# EAGLE design Grove-Base-for-RasPi (EAGLE 7.6.0)
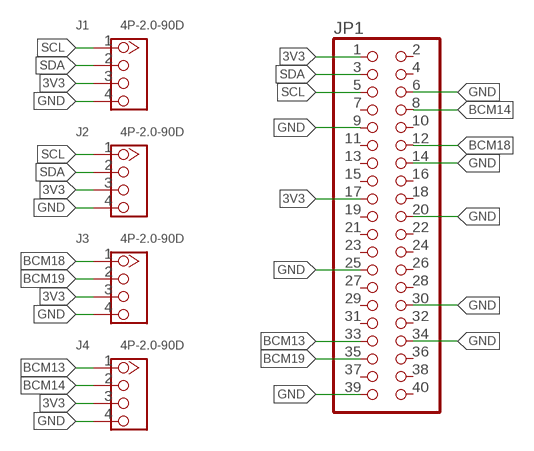
[diagram p0: schematic, sheet 1]

## Parts
J1  4P-2.0-90D  GROVE-CONNECTOR-DIP-90D(4P-2.0)  [HW4-2.0-90D]
J2  4P-2.0-90D  GROVE-CONNECTOR-DIP-90D(4P-2.0)  [HW4-2.0-90D]
J3  4P-2.0-90D  GROVE-CONNECTOR-DIP-90D(4P-2.0)  [HW4-2.0-90D]
J4  4P-2.0-90D  GROVE-CONNECTOR-DIP-90D(4P-2.0)  [HW4-2.0-90D]
JP1  PINHD-2X20  [2X20]

## Nets
3V3: J1.3 J2.3 J3.3 J4.3 JP1.1 JP1.17
BCM13: J4.1 JP1.33
BCM14: J4.2 JP1.8
BCM18: J3.1 JP1.12
BCM19: J3.2 JP1.35
GND: J1.4 J2.4 J3.4 J4.4 JP1.6 JP1.9 JP1.14 JP1.20 JP1.25 JP1.30 JP1.34 JP1.39
SCL: J1.1 J2.1 JP1.5
SDA: J1.2 J2.2 JP1.3
Unconnected: JP1.2 JP1.4 JP1.7 JP1.10 JP1.11 JP1.13 JP1.15 JP1.16 JP1.18 JP1.19 JP1.21 JP1.22 JP1.23 JP1.24 JP1.26 JP1.27 JP1.28 JP1.29 JP1.31 JP1.32 JP1.36 JP1.37 JP1.38 JP1.40

## Library data of the parts
J1-J4 = Seeed-OPL-Connector:GROVE-CONNECTOR-DIP-90D(4P-2.0): 320110034
JP1 = pinhead:PINHD-2X20: PIN HEADER

## Board
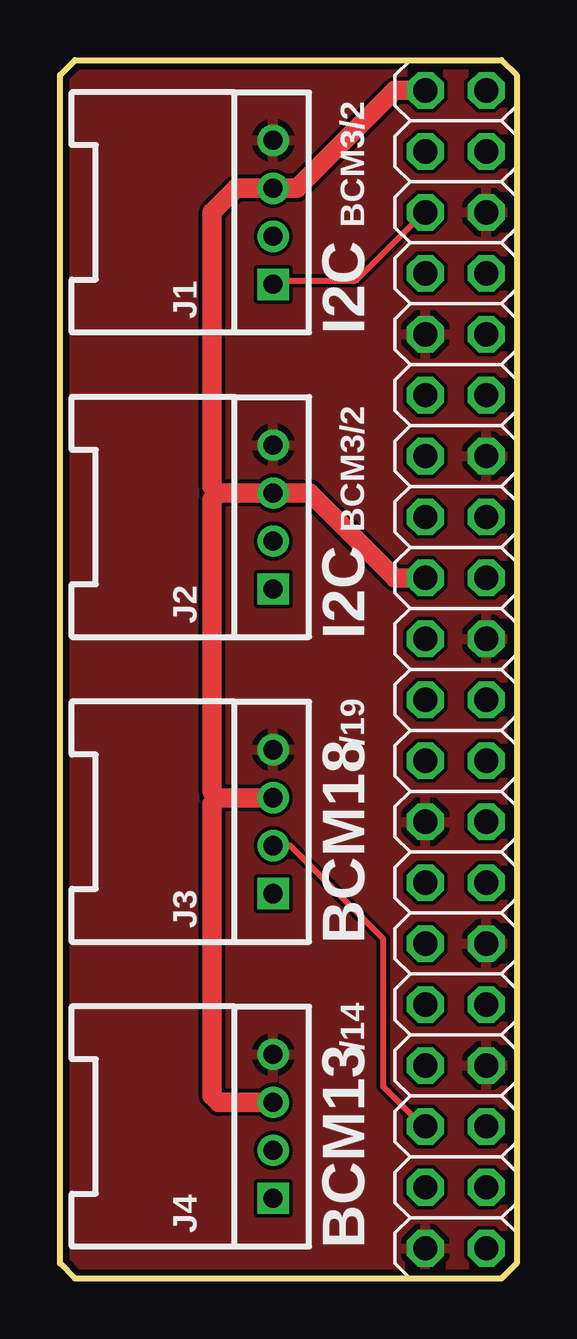
[diagram p1: board, top side]
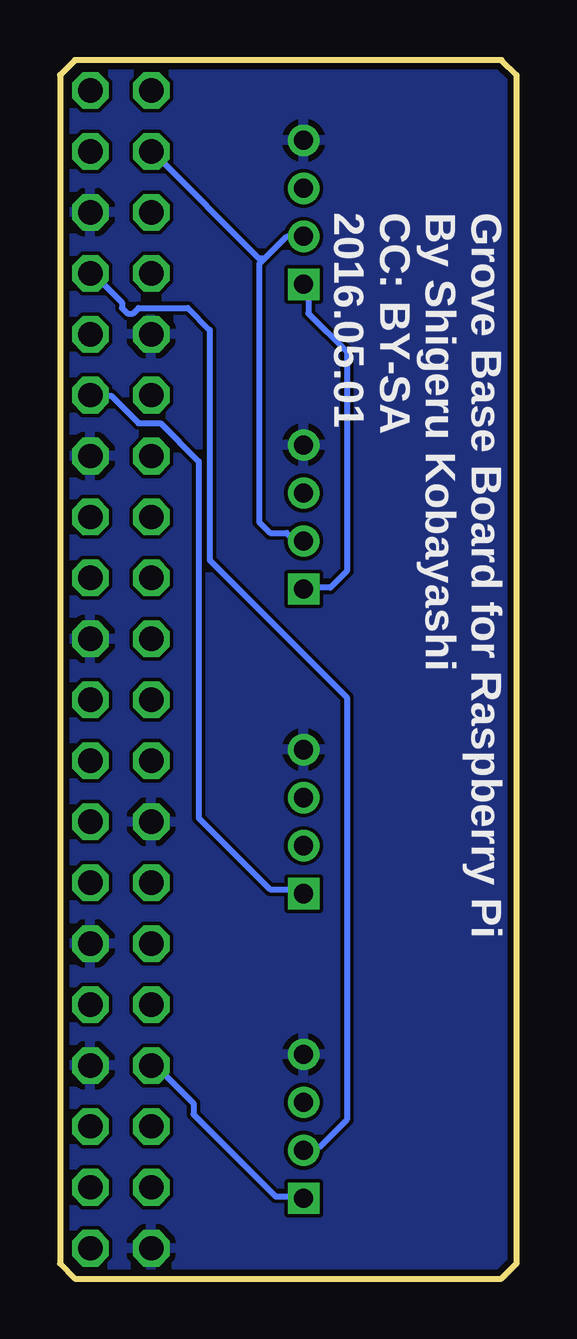
[diagram p2: board, bottom side, seen from below]

Size 19.05 x 50.8 mm. Coordinates in mm from the lower left corner, seen from the top.
Outline: 0,50.16 0.64,50.8 18.41,50.8 19.05,50.16 19.05,0.64 18.41,0 0.64,0 0,0.64 0,50.16
Copper layers (1*16): Top 0.035mm / dielectric 1.5mm / Bottom 0.035mm
Design rules "SeeedStudio_2layer_DRU_no_angle_20140221 *": minimum track width 6mil, minimum drill 12mil, track to track 6mil, track to pad 6mil, pad to pad 6mil, via to via 6mil, smd to smd 0mil, copper to edge 10mil, drill to drill 10mil, minimum pad ring 10mil, minimum via ring 6mil, stop-mask expansion 2mil, vias tented up to drill 100mil, thermal gap 10mil

### Footprints (pad centres in the part's own frame; a part is rotated, then mirrored left to right if it is on the bottom)
HW4-2.0-90D = drill 0.8 pad 1.27 square: 1 -3,0 | drill 0.8 pad 1.27: 2 -1,0; 3 1,0; 4 3,0
2X20 = drill 1.016 octagon: 1 -24.13,-1.27; 2 -24.13,1.27; 3 -21.59,-1.27; 4 -21.59,1.27; 5 -19.05,-1.27; 6 -19.05,1.27; 7 -16.51,-1.27; 8 -16.51,1.27; 9 -13.97,-1.27; 10 -13.97,1.27; 11 -11.43,-1.27; 12 -11.43,1.27; 13 -8.89,-1.27; 14 -8.89,1.27; 15 -6.35,-1.27; 16 -6.35,1.27; 17 -3.81,-1.27; 18 -3.81,1.27; 19 -1.27,-1.27; 20 -1.27,1.27; 21 1.27,-1.27; 22 1.27,1.27; 23 3.81,-1.27; 24 3.81,1.27; 25 6.35,-1.27; 26 6.35,1.27; 27 8.89,-1.27; 28 8.89,1.27; 29 11.43,-1.27; 30 11.43,1.27; 31 13.97,-1.27; 32 13.97,1.27; 33 16.51,-1.27; 34 16.51,1.27; 35 19.05,-1.27; 36 19.05,1.27; 37 21.59,-1.27; 38 21.59,1.27; 39 24.13,-1.27; 40 24.13,1.27

### Placement (x,y rotation side)
J1  8.89,44.45 90 top
J2  8.89,31.75 90 top
J3  8.89,19.05 90 top
J4  8.89,6.35 90 top
JP1  16.51,25.4 270 top

### Tracks (layer width: path | path; a pad name or v marks a point on that pad's centre or on a via)
3V3
  Top 0.813: JP1.1 13.97,49.53 9.89,45.45 J1.3 7.35,45.45 6.35,44.45 6.35,33.02 6.62,32.75 | 6.62,32.75 J2.3 10.43,32.75 13.97,29.21 JP1.17 | J3.3 6.62,20.05 | 6.62,20.05 6.35,20.32 6.35,32.48 6.62,32.75 | J4.3 6.62,7.35 6.35,7.62 6.35,19.78 6.62,20.05
BCM13
  Bottom 0.254: J4.1 8.91,3.43 10.06,3.43 13.49,6.86 13.49,7.32 15.09,8.91 JP1.33
BCM14
  Bottom 0.254: J4.2 8.69,5.49 8.23,5.49 7.09,6.63 7.09,24.23 12.8,29.95 12.8,39.55 13.72,40.46 15.77,40.46 16,40.23 16.23,40.23 16.46,40.46 16.46,40.69 17.6,41.83 JP1.8
BCM18
  Bottom 0.254: J3.1 8.91,16.23 10.29,16.23 13.26,19.2 13.26,34.06 14.86,35.66 15.77,35.66 16.92,36.8 17.6,36.8 JP1.12
BCM19
  Top 0.254: J3.2 8.91,18.06 9.6,18.06 13.49,14.17 13.49,8 15.09,6.4 JP1.35
GND
  pour Bottom: -1.27,52.07 20.32,52.07 20.32,-1.27 -1.27,-1.27
  pour Top: -2.54,53.34 21.59,53.34 21.59,-2.54 -2.54,-2.54
SCL
  Top 0.254: JP1.5 15.09,44.35 12.34,41.6 8.91,41.6 J1.1
  Bottom 0.254: J2.1 8.69,28.8 7.77,28.8 7.09,29.49 7.09,38.63 8.69,40.23 8.69,41.38 J1.1
SDA
  Bottom 0.254: 10.52,42.52 9.6,43.43 8.91,43.43 J1.2 | 10.52,42.52 10.74,42.29 10.74,31.55 10.29,31.09 9.6,31.09 9.37,30.86 8.91,30.86 J2.2 | 10.52,42.52 10.74,42.52 15.09,46.86 JP1.3

### Text on the board
tNames: BCM3/2 | I2C | BCM3/2 | I2C | /19 | BCM18 | /14 | BCM13
bNames: Grove Base Board for Raspberry Pi / By Shigeru Kobayashi / CC: BY-SA / 2016.05.01